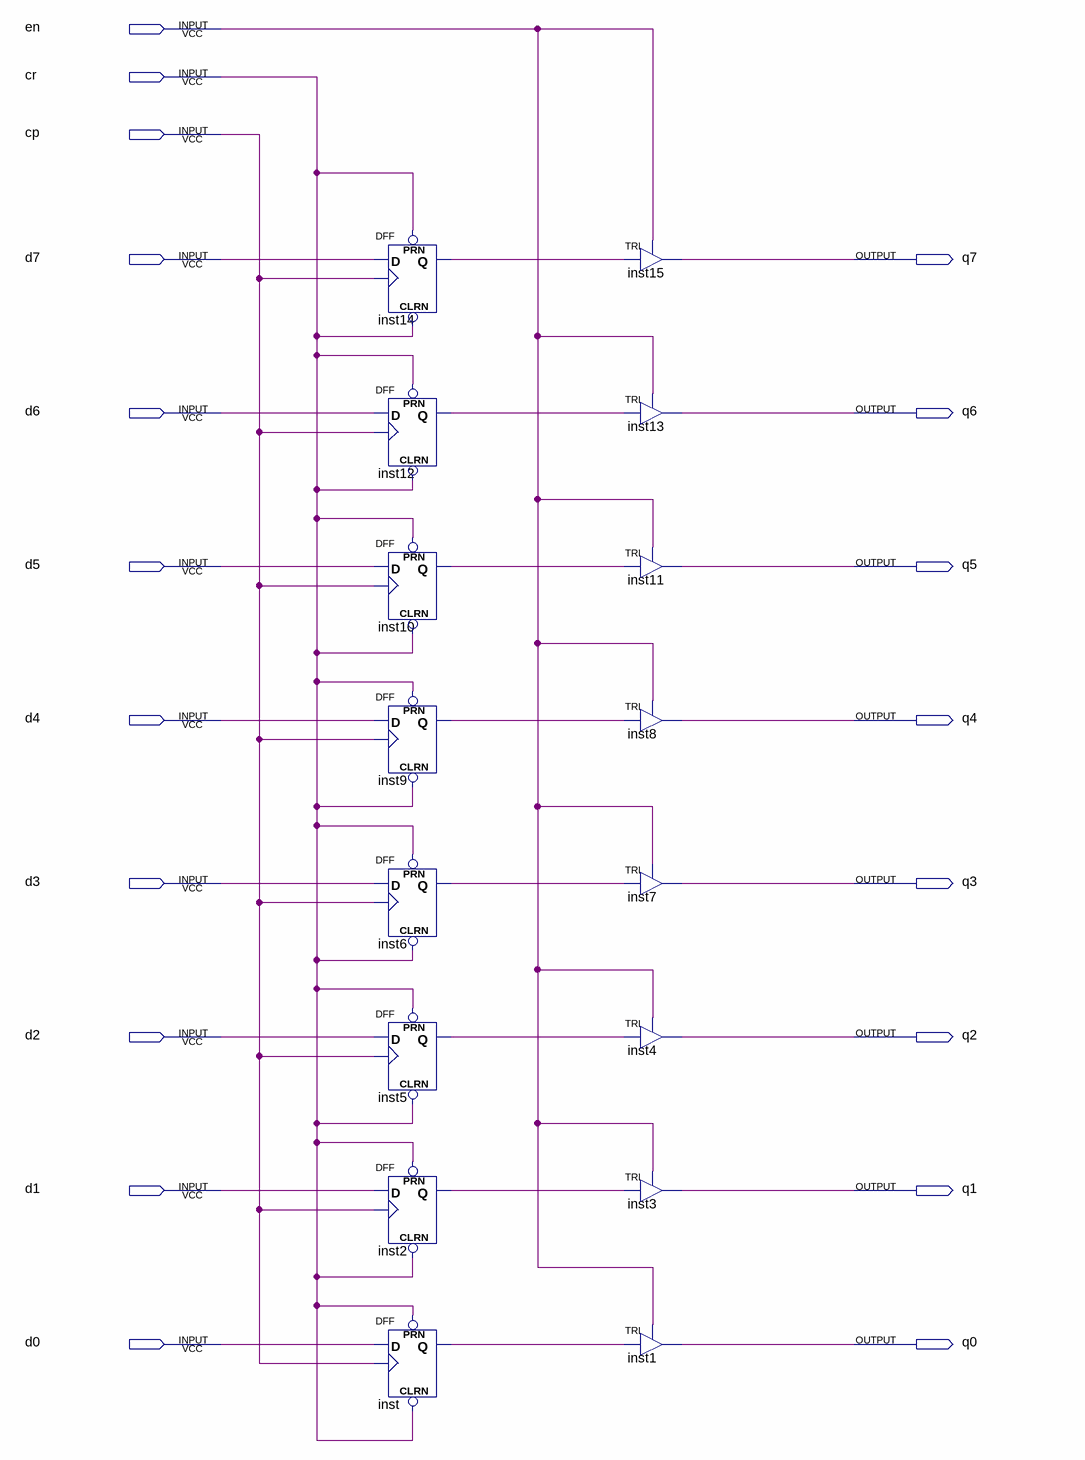
[diagram p0: schematic sheet]
// Quartus schematic My_Tristate_8_bit_Register.bdf as structural Verilog: 16 symbols, 19 pins
module My_Tristate_8_bit_Register (
  input  en,
  input  cr,
  input  cp,
  input  d7,
  input  d6,
  input  d5,
  input  d4,
  input  d3,
  input  d2,
  input  d1,
  input  d0,
  output q7,
  output q6,
  output q5,
  output q4,
  output q3,
  output q2,
  output q1,
  output q0
);

  wire inst2_q, inst5_q, inst6_q, inst9_q, inst10_q, inst12_q, inst14_q, inst_q;

  DFF inst14 (.CLRN(cr), .CLK(cp), .D(d7), .PRN(cr), .Q(inst14_q));
  DFF inst12 (.CLRN(cr), .CLK(cp), .D(d6), .PRN(cr), .Q(inst12_q));
  DFF inst10 (.CLRN(cr), .CLK(cp), .D(d5), .PRN(cr), .Q(inst10_q));
  DFF inst9 (.CLRN(cr), .CLK(cp), .D(d4), .PRN(cr), .Q(inst9_q));
  DFF inst6 (.CLRN(cr), .CLK(cp), .D(d3), .PRN(cr), .Q(inst6_q));
  DFF inst5 (.CLRN(cr), .CLK(cp), .D(d2), .PRN(cr), .Q(inst5_q));
  DFF inst2 (.CLRN(cr), .CLK(cp), .D(d1), .PRN(cr), .Q(inst2_q));
  DFF inst (.CLRN(cr), .CLK(cp), .D(d0), .PRN(cr), .Q(inst_q));
  TRI inst15 (.IN(inst14_q), .OE(en), .OUT(q7));
  TRI inst13 (.IN(inst12_q), .OE(en), .OUT(q6));
  TRI inst11 (.IN(inst10_q), .OE(en), .OUT(q5));
  TRI inst8 (.IN(inst9_q), .OE(en), .OUT(q4));
  TRI inst7 (.IN(inst6_q), .OE(en), .OUT(q3));
  TRI inst4 (.IN(inst5_q), .OE(en), .OUT(q2));
  TRI inst3 (.IN(inst2_q), .OE(en), .OUT(q1));
  TRI inst1 (.IN(inst_q), .OE(en), .OUT(q0));
endmodule
